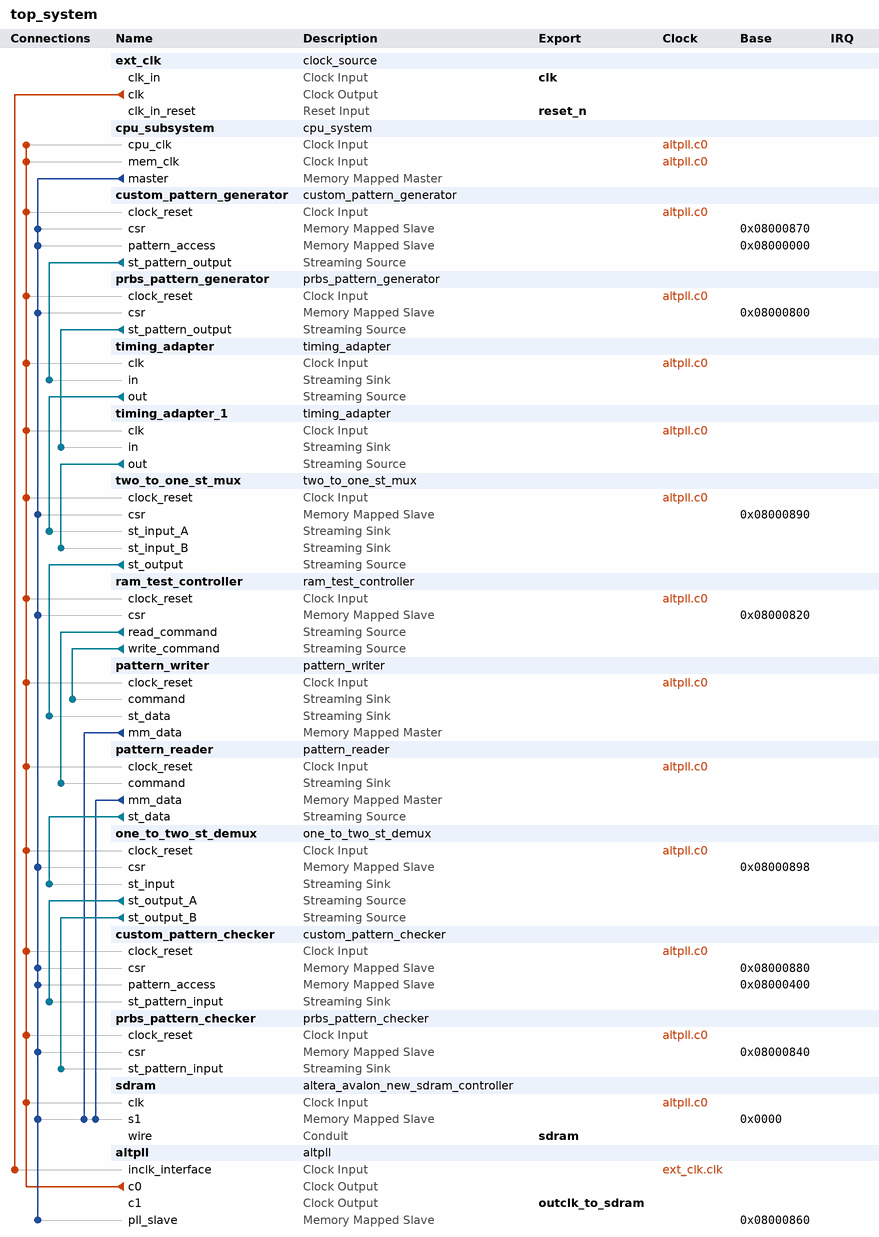
[diagram p0: system contents]
# Platform Designer (Qsys) system top_system
# Parameters at their usual value, and those the tool derives, are not listed.
package require -exact qsys 10.1
create_system top_system
set_project_property DEVICE_FAMILY CYCLONEIVE

add_instance ext_clk clock_source 10.1
set_instance_parameter_value ext_clk clockFrequency 100000000

add_instance cpu_subsystem cpu_system 1.0

add_instance custom_pattern_generator custom_pattern_generator 1.0
set_instance_parameter_value custom_pattern_generator DATA_WIDTH 32
set_instance_parameter_value custom_pattern_generator MAX_PATTERN_LENGTH 256

add_instance prbs_pattern_generator prbs_pattern_generator 1.0
set_instance_parameter_value prbs_pattern_generator DATA_WIDTH 32

add_instance timing_adapter timing_adapter 10.1
set_instance_parameter_value timing_adapter inBitsPerSymbol 8
set_instance_parameter_value timing_adapter inChannelWidth 0
set_instance_parameter_value timing_adapter inErrorWidth 0
set_instance_parameter_value timing_adapter inMaxChannel 0
set_instance_parameter_value timing_adapter inReadyLatency 3
set_instance_parameter_value timing_adapter inSymbolsPerBeat 4
set_instance_parameter_value timing_adapter inUseEmptyPort NO
set_instance_parameter_value timing_adapter inUsePackets false
set_instance_parameter_value timing_adapter inUseReady true
set_instance_parameter_value timing_adapter inUseValid true
set_instance_parameter_value timing_adapter outReadyLatency 0
set_instance_parameter_value timing_adapter outUseReady true
set_instance_parameter_value timing_adapter outUseValid true

add_instance timing_adapter_1 timing_adapter 10.1
set_instance_parameter_value timing_adapter_1 inBitsPerSymbol 8
set_instance_parameter_value timing_adapter_1 inChannelWidth 0
set_instance_parameter_value timing_adapter_1 inErrorWidth 0
set_instance_parameter_value timing_adapter_1 inMaxChannel 0
set_instance_parameter_value timing_adapter_1 inReadyLatency 1
set_instance_parameter_value timing_adapter_1 inSymbolsPerBeat 4
set_instance_parameter_value timing_adapter_1 inUseEmptyPort NO
set_instance_parameter_value timing_adapter_1 inUsePackets false
set_instance_parameter_value timing_adapter_1 inUseReady true
set_instance_parameter_value timing_adapter_1 inUseValid true
set_instance_parameter_value timing_adapter_1 outReadyLatency 0
set_instance_parameter_value timing_adapter_1 outUseReady true
set_instance_parameter_value timing_adapter_1 outUseValid true

add_instance two_to_one_st_mux two_to_one_st_mux 1.0
set_instance_parameter_value two_to_one_st_mux DATA_WIDTH 32

add_instance ram_test_controller ram_test_controller 1.0
set_instance_parameter_value ram_test_controller DEFAULT_TIMER_RESOLUTION 10
set_instance_parameter_value ram_test_controller DEFAULT_BLOCK_SIZE 1024
set_instance_parameter_value ram_test_controller DEFAULT_TRAIL_DISTANCE 1
set_instance_parameter_value ram_test_controller CLOCK_SPEED 100000000

add_instance pattern_writer pattern_writer 1.0
set_instance_parameter_value pattern_writer ADDRESS_WIDTH 27
set_instance_parameter_value pattern_writer LENGTH_WIDTH 21
set_instance_parameter_value pattern_writer DATA_WIDTH 32
set_instance_parameter_value pattern_writer FIFO_DEPTH 128
set_instance_parameter_value pattern_writer BURST_ENABLE 1
set_instance_parameter_value pattern_writer MAX_BURST_COUNT 2
set_instance_parameter_value pattern_writer BURST_REALIGN_ENABLE 1

add_instance pattern_reader pattern_reader 1.0
set_instance_parameter_value pattern_reader ADDRESS_WIDTH 27
set_instance_parameter_value pattern_reader LENGTH_WIDTH 21
set_instance_parameter_value pattern_reader DATA_WIDTH 32
set_instance_parameter_value pattern_reader FIFO_DEPTH 128
set_instance_parameter_value pattern_reader BURST_ENABLE 1
set_instance_parameter_value pattern_reader MAX_BURST_COUNT 2
set_instance_parameter_value pattern_reader BURST_REALIGN_ENABLE 1

add_instance one_to_two_st_demux one_to_two_st_demux 1.0
set_instance_parameter_value one_to_two_st_demux DATA_WIDTH 32

add_instance custom_pattern_checker custom_pattern_checker 1.0
set_instance_parameter_value custom_pattern_checker DATA_WIDTH 32
set_instance_parameter_value custom_pattern_checker MAX_PATTERN_LENGTH 256

add_instance prbs_pattern_checker prbs_pattern_checker 1.0
set_instance_parameter_value prbs_pattern_checker DATA_WIDTH 32

add_instance sdram altera_avalon_new_sdram_controller 10.1
set_instance_parameter_value sdram TAC 5.5
set_instance_parameter_value sdram TRCD 20.0
set_instance_parameter_value sdram TRP 20.0
set_instance_parameter_value sdram casLatency 3
set_instance_parameter_value sdram columnWidth 10
set_instance_parameter_value sdram dataWidth 32
set_instance_parameter_value sdram generateSimulationModel false
set_instance_parameter_value sdram model custom
set_instance_parameter_value sdram numberOfBanks 4
set_instance_parameter_value sdram numberOfChipSelects 1
set_instance_parameter_value sdram powerUpDelay 100.0
set_instance_parameter_value sdram refreshPeriod 15.625
set_instance_parameter_value sdram rowWidth 13

add_instance altpll altpll 10.1
set_instance_parameter_value altpll INCLK0_INPUT_FREQUENCY 10000
set_instance_parameter_value altpll CLK0_MULTIPLY_BY 1
set_instance_parameter_value altpll CLK1_MULTIPLY_BY 1
set_instance_parameter_value altpll CLK0_DIVIDE_BY 1
set_instance_parameter_value altpll CLK1_DIVIDE_BY 1
set_instance_parameter_value altpll CLK1_PHASE_SHIFT -2500
set_instance_parameter_value altpll CLK1_DUTY_CYCLE 50
set_instance_parameter_value altpll PORT_clk1 PORT_USED
set_instance_parameter_value altpll PORT_clk2 PORT_UNUSED
set_instance_parameter_value altpll PORT_clk3 PORT_UNUSED
set_instance_parameter_value altpll PORT_ARESET PORT_UNUSED
set_instance_parameter_value altpll PORT_LOCKED PORT_UNUSED

# connections
add_connection altpll.c0 cpu_subsystem.cpu_clk clock
add_connection altpll.c0 cpu_subsystem.mem_clk clock
add_connection altpll.c0 custom_pattern_checker.clock_reset clock
add_connection altpll.c0 custom_pattern_generator.clock_reset clock
add_connection altpll.c0 one_to_two_st_demux.clock_reset clock
add_connection altpll.c0 pattern_reader.clock_reset clock
add_connection altpll.c0 pattern_writer.clock_reset clock
add_connection altpll.c0 prbs_pattern_checker.clock_reset clock
add_connection altpll.c0 prbs_pattern_generator.clock_reset clock
add_connection altpll.c0 ram_test_controller.clock_reset clock
add_connection altpll.c0 sdram.clk clock
add_connection altpll.c0 timing_adapter.clk clock
add_connection altpll.c0 timing_adapter_1.clk clock
add_connection altpll.c0 two_to_one_st_mux.clock_reset clock
add_connection ext_clk.clk altpll.inclk_interface clock
add_connection cpu_subsystem.master altpll.pll_slave avalon
set_connection_parameter_value cpu_subsystem.master/altpll.pll_slave baseAddress 0x08000860
add_connection cpu_subsystem.master custom_pattern_checker.csr avalon
set_connection_parameter_value cpu_subsystem.master/custom_pattern_checker.csr baseAddress 0x08000880
add_connection cpu_subsystem.master custom_pattern_checker.pattern_access avalon
set_connection_parameter_value cpu_subsystem.master/custom_pattern_checker.pattern_access baseAddress 0x08000400
add_connection cpu_subsystem.master custom_pattern_generator.csr avalon
set_connection_parameter_value cpu_subsystem.master/custom_pattern_generator.csr baseAddress 0x08000870
add_connection cpu_subsystem.master custom_pattern_generator.pattern_access avalon
set_connection_parameter_value cpu_subsystem.master/custom_pattern_generator.pattern_access baseAddress 0x08000000
add_connection cpu_subsystem.master one_to_two_st_demux.csr avalon
set_connection_parameter_value cpu_subsystem.master/one_to_two_st_demux.csr baseAddress 0x08000898
add_connection cpu_subsystem.master prbs_pattern_checker.csr avalon
set_connection_parameter_value cpu_subsystem.master/prbs_pattern_checker.csr baseAddress 0x08000840
add_connection cpu_subsystem.master prbs_pattern_generator.csr avalon
set_connection_parameter_value cpu_subsystem.master/prbs_pattern_generator.csr baseAddress 0x08000800
add_connection cpu_subsystem.master ram_test_controller.csr avalon
set_connection_parameter_value cpu_subsystem.master/ram_test_controller.csr baseAddress 0x08000820
add_connection cpu_subsystem.master sdram.s1 avalon
set_connection_parameter_value cpu_subsystem.master/sdram.s1 baseAddress 0x0000
add_connection cpu_subsystem.master two_to_one_st_mux.csr avalon
set_connection_parameter_value cpu_subsystem.master/two_to_one_st_mux.csr baseAddress 0x08000890
add_connection pattern_reader.mm_data sdram.s1 avalon
set_connection_parameter_value pattern_reader.mm_data/sdram.s1 baseAddress 0x0000
add_connection pattern_writer.mm_data sdram.s1 avalon
set_connection_parameter_value pattern_writer.mm_data/sdram.s1 baseAddress 0x0000
add_connection custom_pattern_generator.st_pattern_output timing_adapter.in avalon_streaming
add_connection one_to_two_st_demux.st_output_A custom_pattern_checker.st_pattern_input avalon_streaming
add_connection one_to_two_st_demux.st_output_B prbs_pattern_checker.st_pattern_input avalon_streaming
add_connection pattern_reader.st_data one_to_two_st_demux.st_input avalon_streaming
add_connection prbs_pattern_generator.st_pattern_output timing_adapter_1.in avalon_streaming
add_connection ram_test_controller.read_command pattern_reader.command avalon_streaming
add_connection ram_test_controller.write_command pattern_writer.command avalon_streaming
add_connection timing_adapter.out two_to_one_st_mux.st_input_A avalon_streaming
add_connection timing_adapter_1.out two_to_one_st_mux.st_input_B avalon_streaming
add_connection two_to_one_st_mux.st_output pattern_writer.st_data avalon_streaming

# exported interfaces
add_interface clk clock sink
set_interface_property clk EXPORT_OF ext_clk.clk_in
add_interface reset_n reset sink
set_interface_property reset_n EXPORT_OF ext_clk.clk_in_reset
add_interface sdram conduit end
set_interface_property sdram EXPORT_OF sdram.wire
add_interface outclk_to_sdram clock source
set_interface_property outclk_to_sdram EXPORT_OF altpll.c1

save_system top_system.qsys
